# Altium project LM2576_Buck_Converter.PrjPcb
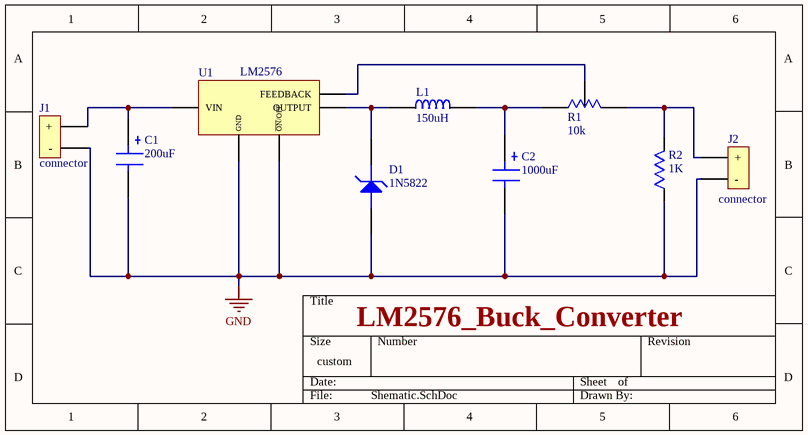
[diagram p0: Shematic.SchDoc]
1 sheet, 9 parts. Net scope: global (net labels, ports and power ports of the same name join across sheets).
Board file: Pcb.PcbDoc

## Sheet Shematic.SchDoc
size 149 x 80 mm

### Parts
C1  200uF  [C_elec - duplicate]
C2  1000uF  [C_elec - duplicate]
D1  1N5822  [1N5822 - duplicate1]
J1  connector  [2PIN_Connector]
J2  connector  [2PIN_Connector]
L1  150uH  [150uH Indicator - duplicate]
R1  10k  [variabel resistor - duplicate]
R2  1K  [R(0805)]
U1  LM2576  [LM2576 - duplicate]

### Nets
GND: C1.2 C2.2 D1.1(Anode) J1.2(-) J2.2(-) R2.1 U1.3(GND) U1.5(~{ON}/OFF)
NetC1_1: C1.1 J1.1(+) U1.1(VIN)
NetC2_1: C2.1 L1.2 R1.1
NetD1_2: D1.2(Cathode) L1.1 U1.2(OUTPUT)
NetJ2_1: J2.1(+) R1.3 R2.2
NetR1_2: R1.2 U1.4(FEEDBACK)

### Notes on the sheet
- LM2576_Buck_Converter

### Library data of the parts
C1 C2 = cap_elec
J1 J2 = 2PIN_Connector
R1 = variable Resistor
R2 = Res